# EasyEDA Pro project Sensor_colis_examples.epro, board 2024-06-03_06-23-40
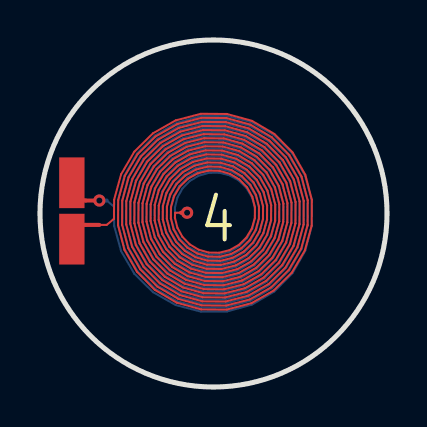
[diagram p6: board, top side]
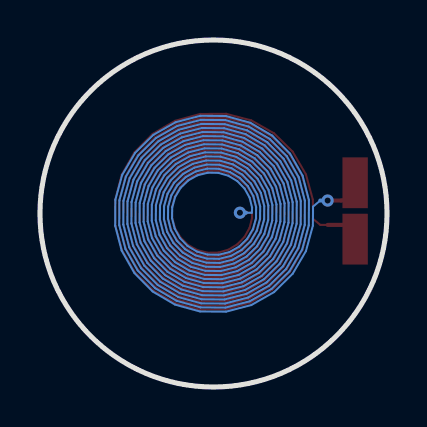
[diagram p7: board, bottom side, seen from below]

Outline 17.36 x 17.36 mm; copper layers: Top Layer, Bottom Layer. Coordinates in mm from the lower left corner of the outline.
Outline path: circle c8.68,8.68 r8.68
Stack: Top Layer 0.035mm - / Dielectric1 1.51mm FR4 er 4.5 / Bottom Layer 0.035mm -

## Design rules (mm)
template: 用户自定义配置
spacing safeClearance (default): track to track 0.152, other pairs 0.152 to 0.3
track width trackWidth (default): min 0.025, default 0.254, max 2.54
differential pair differentialPair (default): width min 0.127, default 0.254, max 2.54; gap min 0.152, default 0.152
via viaSize (default): diameter min 0.5, default 0.61, max 10; hole min 0.3, default 0.305, max 5.999

## Placement (name value [footprint] x y rotation side)
CSENSOR  -  [0805]  1.59 8.81 90 top

## Footprints (pads in the part's own frame, mm; a bottom-side part is the same pattern mirrored in y, then rotated)
0805
  rect 2.54x1.27 smd: 1(-1.409,0) 2(1.409,0)

## Nets
3: CSENSOR.1 CSENSOR.2

## Via types
v1: diameter 0.61, hole 0.305, Top Layer to Bottom Layer, 2 vias

## Routing (per net, layer and track width the routed paths; a pad name or vN(x,y) marks a point on that pad's centre or on a via; arc(x,y) is an arc through that point)
3: length 664.4
  Top Layer w0.102: 2.97,8.11 3.34,8.11 3.7,8.41 3.7,8.72 3.71,9.38 4.06,10.64 4.72,11.77 5.65,12.69 6.79,13.34 8.05,13.67 9.35,13.66 10.61,13.32 11.72,12.66 12.63,11.74 13.27,10.61 13.6,9.36 13.59,8.08 13.25,6.84 12.6,5.73 11.69,4.83 10.58,4.19 9.34,3.87 8.06,3.88 6.84,4.22 5.74,4.86 4.85,5.76 4.22,6.87 3.91,8.09 3.91,9.35 4.25,10.56 4.88,11.65 5.78,12.53 6.87,13.15 8.08,13.47 9.33,13.46 10.53,13.13 11.6,12.5 12.47,11.61 13.08,10.54 13.4,9.34 13.39,8.1 13.06,6.91 12.44,5.85 11.56,4.99 10.5,4.38 9.31,4.08 8.09,4.08 6.92,4.41 5.87,5.02 5.01,5.89 4.41,6.94 4.11,8.11 4.12,9.32 4.44,10.49 5.05,11.52 5.9,12.37 6.95,12.96 8.1,13.26 9.3,13.25 10.45,12.94 11.48,12.33 12.31,11.49 12.9,10.46 13.19,9.31 13.18,8.13 12.87,6.99 12.28,5.98 11.44,5.15 10.42,4.57 9.29,4.28 8.12,4.29 6.99,4.6 5.99,5.19 5.18,6.01 4.6,7.02 4.31,8.14 4.32,9.3 4.63,10.41 5.21,11.4 6.03,12.21 7.02,12.77 8.13,13.06 9.27,13.05 10.37,12.75 11.35,12.17 12.15,11.36 12.71,10.38 12.99,9.28 12.98,8.16 12.68,7.07 12.11,6.1 11.31,5.32 10.34,4.76 9.26,4.48 8.14,4.49 7.07,4.79 6.12,5.35 5.34,6.14 4.79,7.1 4.51,8.17 4.52,9.27 4.82,10.33 5.37,11.27 6.15,12.04 7.1,12.58 8.16,12.86 9.25,12.85 10.29,12.56 11.23,12.01 11.98,11.24 12.52,10.3 12.79,9.26 12.78,8.18 12.49,7.15 11.95,6.23 11.19,5.48 10.26,4.95 9.23,4.69 8.17,4.69 7.15,4.98 6.24,5.51 5.5,6.26 4.98,7.18 4.72,8.2 4.73,9.24 5.01,10.25 5.53,11.15 6.28,11.88 7.18,12.39 8.18,12.65 9.22,12.64 10.21,12.37 11.1,11.85 11.82,11.11 12.33,10.22 12.58,9.23 12.58,8.21 12.3,7.23 11.79,6.35 11.06,5.64 10.18,5.14 9.21,4.89 8.2,4.9 7.23,5.17 6.36,5.67 5.66,6.39 5.17,7.26 4.92,8.22 4.93,9.22 5.19,10.17 5.7,11.03 6.4,11.72 7.26,12.2 8.21,12.45 9.19,12.44 10.13,12.18 10.98,11.68 11.66,10.99 12.14,10.14 12.38,9.2 12.37,8.24 12.11,7.31 11.63,6.48 10.94,5.8 10.11,5.33 9.18,5.09 8.23,5.1 7.31,5.35 6.49,5.84 5.83,6.51 5.36,7.34 5.12,8.25 5.13,9.19 5.38,10.09 5.86,10.9 6.53,11.56 7.34,12.01 8.24,12.25 9.16,12.24 10.06,11.99 10.85,11.52 11.5,10.86 11.95,10.06 12.18,9.18 12.17,8.26 11.92,7.38 11.46,6.6 10.81,5.97 10.03,5.52 9.15,5.29 8.25,5.3 7.39,5.54 6.61,6 5.99,6.64 5.55,7.41 5.33,8.28 5.34,9.16 5.57,10.02 6.02,10.78 6.65,11.39 7.42,11.82 8.26,12.04 9.14,12.03 9.98,11.8 10.73,11.36 11.33,10.74 11.76,9.99 11.97,9.15 11.97,8.29 11.74,7.46 11.3,6.73 10.69,6.13 9.95,5.71 9.13,5.5 8.28,5.51 7.46,5.73 6.74,6.16 6.15,6.76 5.74,7.49 5.53,8.3 5.54,9.14 5.76,9.94 6.18,10.65 6.78,11.23 7.49,11.63 8.29,11.84 9.11,11.83 9.9,11.61 10.6,11.2 11.17,10.61 11.57,9.91 11.77,9.12 11.76,8.32 11.55,7.54 11.14,6.85 10.57,6.29 9.87,5.9 9.1,5.7 8.31,5.71 7.54,5.92 6.86,6.32 6.31,6.89 5.93,7.57 5.73,8.33 5.74,9.11 5.95,9.86 6.35,10.53 6.9,11.07 7.57,11.45 8.32,11.64 9.08,11.63 9.82,11.42 10.48,11.03 11.01,10.49 11.38,9.83 11.57,9.1 11.56,8.34 11.36,7.62 10.97,6.98 10.44,6.45 9.79,6.09 9.07,5.9 8.33,5.91 7.62,6.11 6.99,6.49 6.48,7.01 6.12,7.65 5.94,8.36 5.95,9.08 6.14,9.78 6.51,10.4 7.03,10.9 7.65,11.26 8.34,11.43 9.06,11.42 9.74,11.23 10.35,10.87 10.85,10.37 11.19,9.75 11.36,9.07 11.36,8.37 11.17,7.7 10.81,7.1 10.32,6.62 9.71,6.28 9.05,6.11 8.36,6.12 7.7,6.3 7.11,6.65 6.64,7.14 6.31,7.73 6.14,8.38 6.15,9.06 6.33,9.7 6.67,10.28 7.15,10.74 7.73,11.07 8.37,11.23 9.03,11.22 9.66,11.04 10.23,10.71 10.68,10.24 11,9.67 11.16,9.04 11.15,8.4 10.98,7.78 10.65,7.23 10.19,6.78 9.63,6.47 9.02,6.31 8.39,6.32 7.78,6.49 7.24,6.81 6.8,7.26 6.5,7.81 6.34,8.41 6.35,9.03 6.52,9.62 6.84,10.15 7.27,10.58 7.81,10.88 8.4,11.03 9,11.02 9.59,10.85 10.1,10.55 10.52,10.12 10.81,9.59 10.96,9.02 10.95,8.42 10.79,7.86 10.49,7.35 10.07,6.94 9.56,6.66 8.99,6.51 8.41,6.52 7.86,6.68 7.36,6.98 6.96,7.39 6.69,7.88 6.55,8.44 6.56,9 6.71,9.54 7,10.03 7.4,10.42 7.89,10.69 8.42,10.82 8.98,10.82 9.51,10.66 9.98,10.38 10.36,9.99 10.62,9.52 10.75,8.99 10.75,8.45 10.6,7.93 10.32,7.47 9.94,7.1 9.48,6.85 8.97,6.72 8.44,6.73 7.94,6.87 7.49,7.14 7.13,7.51 6.88,7.96 6.75,8.46 6.76,8.72 7.06,8.72
  Top Layer w0.203: v1(7.36,8.72) 7.06,8.72 ; 2.97,8.11 1.6,8.11 ; 1.6,9.51 1.6,9.42 2.29,9.33 v1(2.97,9.33)
  Bottom Layer w0.102: 3.34,9.33 3.7,9.02 3.7,8.72 3.71,8.06 4.06,6.8 4.72,5.67 5.65,4.75 6.79,4.1 8.05,3.77 9.35,3.78 10.61,4.12 11.72,4.78 12.63,5.7 13.27,6.83 13.6,8.07 13.59,9.36 13.25,10.6 12.6,11.71 11.69,12.61 10.58,13.24 9.34,13.57 8.06,13.56 6.84,13.22 5.74,12.58 4.85,11.68 4.22,10.57 3.91,9.35 3.91,8.09 4.25,6.87 4.88,5.79 5.78,4.91 6.87,4.29 8.08,3.97 9.33,3.98 10.53,4.31 11.6,4.94 12.47,5.83 13.08,6.9 13.4,8.1 13.39,9.34 13.06,10.53 12.44,11.59 11.56,12.45 10.5,13.06 9.31,13.36 8.09,13.36 6.92,13.03 5.87,12.42 5.01,11.55 4.41,10.5 4.11,9.32 4.12,8.12 4.44,6.95 5.05,5.92 5.9,5.07 6.95,4.48 8.1,4.18 9.3,4.19 10.45,4.5 11.48,5.11 12.31,5.95 12.9,6.98 13.19,8.13 13.18,9.31 12.87,10.45 12.28,11.46 11.44,12.29 10.42,12.87 9.29,13.16 8.12,13.15 6.99,12.84 5.99,12.25 5.18,11.43 4.6,10.42 4.31,9.3 4.32,8.14 4.63,7.03 5.21,6.04 6.03,5.23 7.02,4.67 8.13,4.38 9.27,4.39 10.37,4.69 11.35,5.27 12.15,6.08 12.71,7.06 12.99,8.16 12.98,9.28 12.68,10.37 12.11,11.34 11.31,12.12 10.34,12.68 9.26,12.96 8.14,12.95 7.07,12.65 6.12,12.09 5.34,11.3 4.79,10.34 4.51,9.27 4.52,8.17 4.82,7.11 5.37,6.16 6.15,5.4 7.1,4.86 8.16,4.58 9.25,4.59 10.29,4.88 11.23,5.43 11.98,6.2 12.52,7.14 12.79,8.18 12.78,9.26 12.49,10.29 11.95,11.21 11.19,11.96 10.26,12.49 9.23,12.75 8.17,12.75 7.15,12.46 6.24,11.93 5.5,11.18 4.98,10.26 4.72,9.24 4.73,8.2 5.01,7.19 5.53,6.29 6.28,5.56 7.18,5.05 8.18,4.79 9.22,4.8 10.21,5.07 11.1,5.59 11.82,6.33 12.33,7.22 12.58,8.21 12.58,9.23 12.3,10.21 11.79,11.09 11.06,11.8 10.18,12.3 9.21,12.55 8.2,12.54 7.23,12.27 6.36,11.77 5.66,11.05 5.17,10.18 4.92,9.22 4.93,8.22 5.19,7.27 5.7,6.41 6.4,5.72 7.26,5.24 8.21,4.99 9.19,5 10.13,5.26 10.98,5.76 11.66,6.45 12.14,7.3 12.38,8.24 12.37,9.2 12.11,10.13 11.63,10.96 10.94,11.64 10.11,12.11 9.18,12.35 8.23,12.34 7.31,12.08 6.49,11.6 5.83,10.93 5.36,10.1 5.12,9.19 5.13,8.25 5.38,7.35 5.86,6.54 6.53,5.88 7.34,5.43 8.24,5.19 9.16,5.2 10.06,5.45 10.85,5.92 11.5,6.58 11.95,7.37 12.18,8.26 12.17,9.18 11.92,10.05 11.46,10.84 10.81,11.47 10.03,11.92 9.15,12.14 8.25,12.14 7.39,11.9 6.61,11.44 5.99,10.8 5.55,10.03 5.33,9.16 5.34,8.28 5.57,7.42 6.02,6.66 6.65,6.05 7.42,5.62 8.26,5.4 9.14,5.41 9.98,5.64 10.73,6.08 11.33,6.7 11.76,7.45 11.97,8.29 11.97,9.15 11.74,9.98 11.3,10.71 10.69,11.31 9.95,11.73 9.13,11.94 8.28,11.93 7.46,11.71 6.74,11.28 6.15,10.68 5.74,9.95 5.53,9.14 5.54,8.3 5.76,7.5 6.18,6.79 6.78,6.21 7.49,5.8 8.29,5.6 9.11,5.61 9.9,5.83 10.6,6.24 11.17,6.82 11.57,7.53 11.77,8.32 11.76,9.12 11.55,9.9 11.14,10.59 10.57,11.15 9.87,11.54 9.1,11.74 8.31,11.73 7.54,11.52 6.86,11.11 6.31,10.55 5.93,9.87 5.73,9.11 5.74,8.33 5.95,7.58 6.35,6.91 6.9,6.37 7.57,5.99 8.32,5.8 9.08,5.81 9.82,6.02 10.48,6.41 11.01,6.95 11.38,7.61 11.57,8.34 11.56,9.1 11.36,9.82 10.97,10.46 10.44,10.99 9.79,11.35 9.07,11.53 8.33,11.53 7.62,11.33 6.99,10.95 6.48,10.43 6.12,9.79 5.94,9.08 5.95,8.36 6.14,7.66 6.51,7.04 7.03,6.53 7.65,6.18 8.34,6.01 9.06,6.01 9.74,6.21 10.35,6.57 10.85,7.07 11.19,7.69 11.36,8.37 11.36,9.07 11.17,9.74 10.81,10.34 10.32,10.82 9.71,11.16 9.05,11.33 8.36,11.32 7.7,11.14 7.11,10.79 6.64,10.3 6.31,9.71 6.14,9.06 6.15,8.38 6.33,7.74 6.67,7.16 7.15,6.7 7.73,6.37 8.37,6.21 9.03,6.22 9.66,6.4 10.23,6.73 10.68,7.2 11,7.77 11.16,8.4 11.15,9.04 10.98,9.66 10.65,10.21 10.19,10.66 9.63,10.97 9.02,11.13 8.39,11.12 7.78,10.95 7.24,10.63 6.8,10.18 6.5,9.63 6.34,9.03 6.35,8.41 6.52,7.82 6.84,7.29 7.27,6.86 7.81,6.56 8.4,6.41 9,6.42 9.59,6.59 10.1,6.89 10.52,7.32 10.81,7.85 10.96,8.42 10.95,9.02 10.79,9.58 10.49,10.09 10.07,10.5 9.56,10.78 8.99,10.93 8.41,10.92 7.86,10.76 7.36,10.46 6.96,10.05 6.69,9.55 6.55,9 6.56,8.44 6.71,7.89 7,7.41 7.4,7.02 7.89,6.75 8.42,6.62 8.98,6.62 9.51,6.77 9.98,7.06 10.36,7.45 10.62,7.92 10.75,8.45 10.75,8.99 10.6,9.51 10.32,9.96 9.94,10.34 9.48,10.59 8.97,10.72 8.44,10.71 7.94,10.57 7.49,10.3 7.13,9.93 6.88,9.48 6.75,8.98 6.76,8.72 7.06,8.72
  Bottom Layer w0.203: v1(7.36,8.72) 7.06,8.72 ; 3.34,9.33 v1(2.97,9.33)

## Text on the board
Top Silkscreen Layer: Layers = 2 | Turns = 15 | Version - 1.1 | -------------- | Design Id - 106 | Coil Parameters | Customized for LDC1612 | Trace Width = 4.0 mils | Layer Stack Information | Trace Spacing = 4.0 mils | ------------------------- | WEBENCH Design Information | Copper thickness = 1.0 Oz-Cu | Exported on - 2024/06/03 06:23:38 | Inner Diameter = 154 mils (Approx.) | Outer Diameter = 394 mils (Approx.) | Space between TOP and BOTTOM = 4.0 mils | Exported from WEBENCH Coil Designer Tool | 4
